# EAGLE design Top (EAGLE 9.6.1)
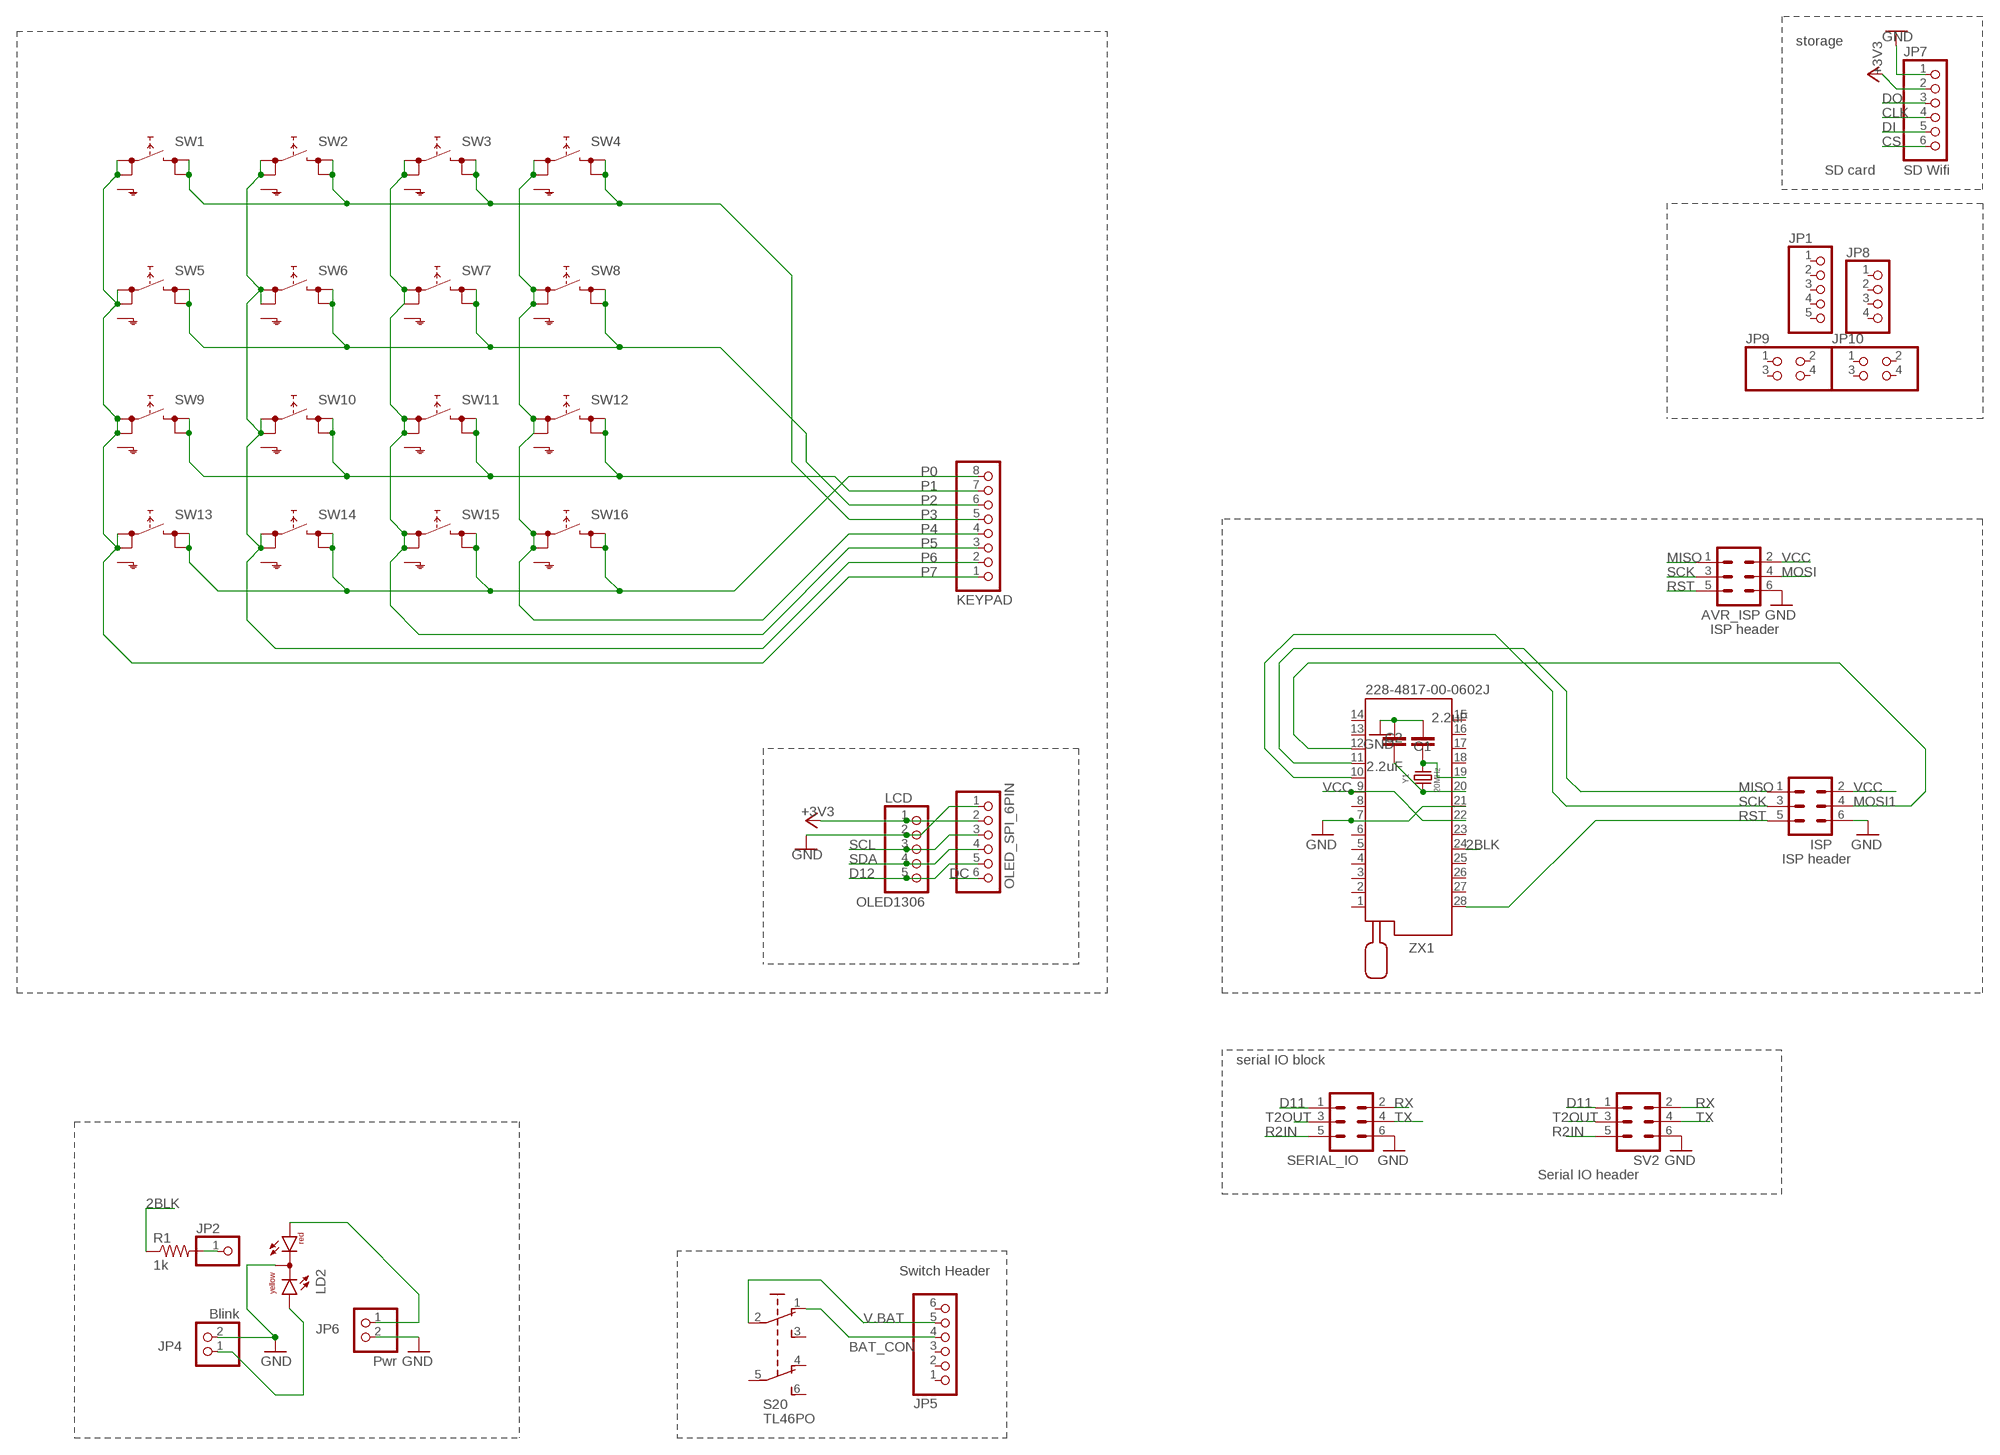
[diagram p0: schematic, sheet 1]

## Parts
AVR_ISP  ML6  [ML6]
C1  2.2uF  2.2UF-1206-50V-10%  [1206]
C2  2.2uF  2.2UF-1206-50V-10%  [1206]
ISP  ML6  [ML6]
JP1  PINHD-1X5  [1X05]
JP2  PINHD-1X1  [1X01]
JP4  Blink  PINHD-1X2  [1X02]
JP5  Switch Header  PINHD-1X6  [1X06]
JP6  Pwr  PINHD-1X2  [1X02]
JP7  SD Wifi  PINHD-1X6  [1X06]
JP8  PINHD-1X4  [1X04]
JP9  PINHD-2X2  [2X02]
JP10  PINHD-2X2  [2X02]
KEYPAD  PINHD-1X8  [1X08]
LCD  OLED1306  PINHD-1X5  [1X05]
LD2  DUOLED-RY-C  [DUOLED-C-5MM]
OLED_SPI_6PIN  PINHD-1X6  [1X06]
R1  1k  R-US_M1206  [M1206]
S20  TL46PO  [TL4XPO]
SERIAL_IO  ML6  [ML6]
SV2  ML6  [ML6]
SW1  SKHMPSE010  [SKHMPXE010]
SW2  SKHMPSE010  [SKHMPXE010]
SW3  SKHMPSE010  [SKHMPXE010]
SW4  SKHMPSE010  [SKHMPXE010]
SW5  SKHMPSE010  [SKHMPXE010]
SW6  SKHMPSE010  [SKHMPXE010]
SW7  SKHMPSE010  [SKHMPXE010]
SW8  SKHMPSE010  [SKHMPXE010]
SW9  SKHMPSE010  [SKHMPXE010]
SW10  SKHMPSE010  [SKHMPXE010]
SW11  SKHMPSE010  [SKHMPXE010]
SW12  SKHMPSE010  [SKHMPXE010]
SW13  SKHMPSE010  [SKHMPXE010]
SW14  SKHMPSE010  [SKHMPXE010]
SW15  SKHMPSE010  [SKHMPXE010]
SW16  SKHMPSE010  [SKHMPXE010]
Y1  20MHz  WE-XTAL_HC49/4HSMX_830061856  [WE-XTAL_HC49/4HSMX]
ZX1  228-4817-00-0602J  [228-4817-00-0602J]

## Nets
2BLK: R1.1 ZX1.24
+3V3: JP7.2 LCD.1 OLED_SPI_6PIN.2
BAT_CON: JP5.4 S20.1(O)
CLK: JP7.4
CS: JP7.6
D11: SERIAL_IO.1 SV2.1
D12: LCD.5 OLED_SPI_6PIN.5
DC: OLED_SPI_6PIN.6
DI: JP7.5
DO: JP7.3
GND: AVR_ISP.6 C1.2 C2.1 ISP.6 JP4.2 JP6.2 JP7.1 LCD.2 LD2.C OLED_SPI_6PIN.1 SERIAL_IO.6 SV2.6 ZX1.7 ZX1.21
MISO: AVR_ISP.1 ISP.1 ZX1.11
MOSI: AVR_ISP.4
MOSI1: ISP.4 ZX1.12
N$1: C1.1 Y1.2 ZX1.19
N$2: C2.2 Y1.1 ZX1.20
N$3: JP6.1 LD2.AR
N$4: JP2.1 R1.2
N$14: JP4.1 LD2.AX(AY)
P0: KEYPAD.8 SW13.3(2.1) SW13.4(2.2) SW14.3(2.1) SW14.4(2.2) SW15.3(2.1) SW15.4(2.2) SW16.3(2.1) SW16.4(2.2)
P1: KEYPAD.7 SW9.3(2.1) SW9.4(2.2) SW10.3(2.1) SW10.4(2.2) SW11.3(2.1) SW11.4(2.2) SW12.3(2.1) SW12.4(2.2)
P2: KEYPAD.6 SW5.3(2.1) SW5.4(2.2) SW6.3(2.1) SW6.4(2.2) SW7.3(2.1) SW7.4(2.2) SW8.3(2.1) SW8.4(2.2)
P3 [POWER]: KEYPAD.5 SW1.3(2.1) SW1.4(2.2) SW2.3(2.1) SW2.4(2.2) SW3.3(2.1) SW3.4(2.2) SW4.3(2.1) SW4.4(2.2)
P4: KEYPAD.4 SW4.1(1.1) SW4.2(1.2) SW8.1(1.1) SW8.2(1.2) SW12.1(1.1) SW12.2(1.2) SW16.1(1.1) SW16.2(1.2)
P5: KEYPAD.3 SW3.1(1.1) SW3.2(1.2) SW7.1(1.1) SW7.2(1.2) SW11.1(1.1) SW11.2(1.2) SW15.1(1.1) SW15.2(1.2)
P6: KEYPAD.2 SW2.1(1.1) SW2.2(1.2) SW6.1(1.1) SW6.2(1.2) SW10.1(1.1) SW10.2(1.2) SW14.1(1.1) SW14.2(1.2)
P7: KEYPAD.1 SW1.1(1.1) SW1.2(1.2) SW5.1(1.1) SW5.2(1.2) SW9.1(1.1) SW9.2(1.2) SW13.1(1.1) SW13.2(1.2)
R2IN: SERIAL_IO.5 SV2.5
RST: AVR_ISP.5 ISP.5 ZX1.28
RX: SERIAL_IO.2 SV2.2
SCK: AVR_ISP.3 ISP.3 ZX1.10
SCL: LCD.3 OLED_SPI_6PIN.3
SDA: LCD.4 OLED_SPI_6PIN.4
T2OUT: SERIAL_IO.3 SV2.3
TX: SERIAL_IO.4 SV2.4
V.BAT: JP5.5 S20.2(P)
VCC: AVR_ISP.2 ISP.2 ZX1.9 ZX1.22
Unconnected: JP1.1 JP1.2 JP1.3 JP1.4 JP1.5 JP5.1 JP5.2 JP5.3 JP5.6 JP8.1 JP8.2 JP8.3 JP8.4 JP9.1 JP9.2 JP9.3 JP9.4 JP10.1 JP10.2 JP10.3 JP10.4 S20.3(S) S20.4(O1) S20.5(P1) S20.6(S1) SW1.5(SH) SW2.5(SH) SW3.5(SH) SW4.5(SH) SW5.5(SH) SW6.5(SH) SW7.5(SH) SW8.5(SH) SW9.5(SH) SW10.5(SH) SW11.5(SH) SW12.5(SH) SW13.5(SH) SW14.5(SH) SW15.5(SH) SW16.5(SH) ZX1.1 ZX1.2 ZX1.3 ZX1.4 ZX1.5 ZX1.6 ZX1.8 ZX1.13 ZX1.14 ZX1.15 ZX1.16 ZX1.17 ZX1.18 ZX1.23 ZX1.25 ZX1.26 ZX1.27

## Notes on the sheet
- storage
- SD card
- ISP header
- ISP header
- serial IO block
- Serial IO header

## Library data of the parts
AVR_ISP ISP SERIAL_IO SV2 = con-harting-ml:ML6: HARTING
C1 C2 = SparkFun-Capacitors:2.2UF: 2.2µF ceramic capacitors A capacitor is a passive two-terminal electrical component used to store electrical energy temporarily in an electric field.; PROD_ID: CAP-10009
JP1 LCD = pinhead:PINHD-1X5: PIN HEADER
JP2 = pinhead:PINHD-1X1: PIN HEADER
JP4 JP6 = pinhead:PINHD-1X2: PIN HEADER
JP5 JP7 OLED_SPI_6PIN = pinhead:PINHD-1X6: PIN HEADER
JP8 = pinhead:PINHD-1X4: PIN HEADER
JP9 JP10 = pinhead:PINHD-2X2: PIN HEADER
KEYPAD = pinhead:PINHD-1X8: PIN HEADER
LD2 = led:DUOLED-RY-C: DUO LED 2 colors (red/yellow), 5 mm, round, common Cathode www.ligitek.com or other producers.
R1 = rcl:R-US_: RESISTOR, American symbol; SPICEPREFIX: R
S20 = switch:TL46PO: TINY SWITCH ON - ON Source: http://www2.produktinfo.conrad.com/datenblaetter/700000-724999/705152-da-01-de-Subminiaturschalter_TL_36YO.pdf
SW1-SW16 = switch:SKHMP*E010: 6.2 X 6.5mm TACT Switch (SMD) Source: http://www3.alps.co.jp/WebObjects/catalog.woa/PDF/E/Switch/Tact/SKHM/SKHM.PDF
Y1 = Wurth_Quartz Crystals & Oscillators_WE-XTAL:WE-XTAL_HC49/4HSMX: WE-XTAL Quartz Crystal Characteristics SMT and THT models Hermetically sealed Frequencies between 1.8432 MHz and 50 MHz Tolerances down to ±10 ppm available Maximum operating temperatures range: -40 °C to 85 °C Stabilities down to ±10 ppm available Applications Microprocessor Wireless Communication Devices Industrial Devices Wired Communication (e.g. Ethernet and USB) IoT Optical Network Audio and Multimedia Devices Test and Measurement Equipment Navigation and Locators Wearables <https://www.we-online.com/catalog/media/o135919v209%20Family_WE-XTAL_IQXC-42.jpg> Details see: https://www.we-online.com/catalog/en/WE-XTAL Updated by Ella Wu , 2019-09-03 2019 (C) Wurth Elektronik; C-LOAD: 18pF; DATASHEET-URL: https://www.we-online.com/catalog/datasheet/830061856.pdf; MOUNT: SMT; PART-NUMBER: 830061856; STABILITY: 10ppm; TOLERANCE: ±10ppm
ZX1 = con-3m:228-?00-0602J: Zero Insertion Force Socked Source: http://www.3M.com/ehpd; MF: 3M; MPN: 228-4817-00-0602J; OC_FARNELL: 1252775; OC_NEWARK: 85K7834

## Net classes
0 default: width 0.254 mm, clearance 0.254 mm
1 POWER: width 0.254 mm, clearance 0.254 mm

## Board
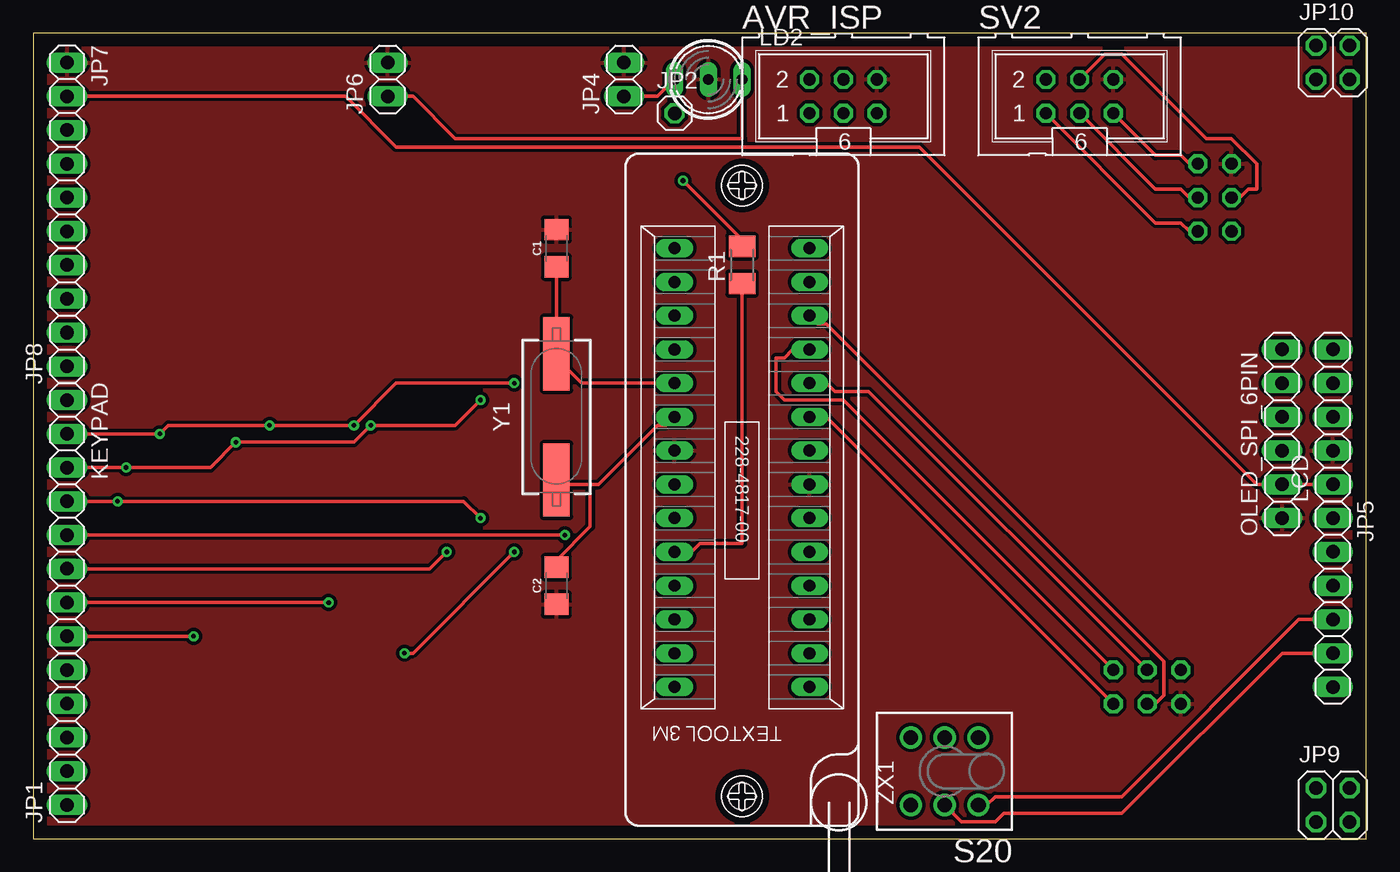
[diagram p1: board, top side]
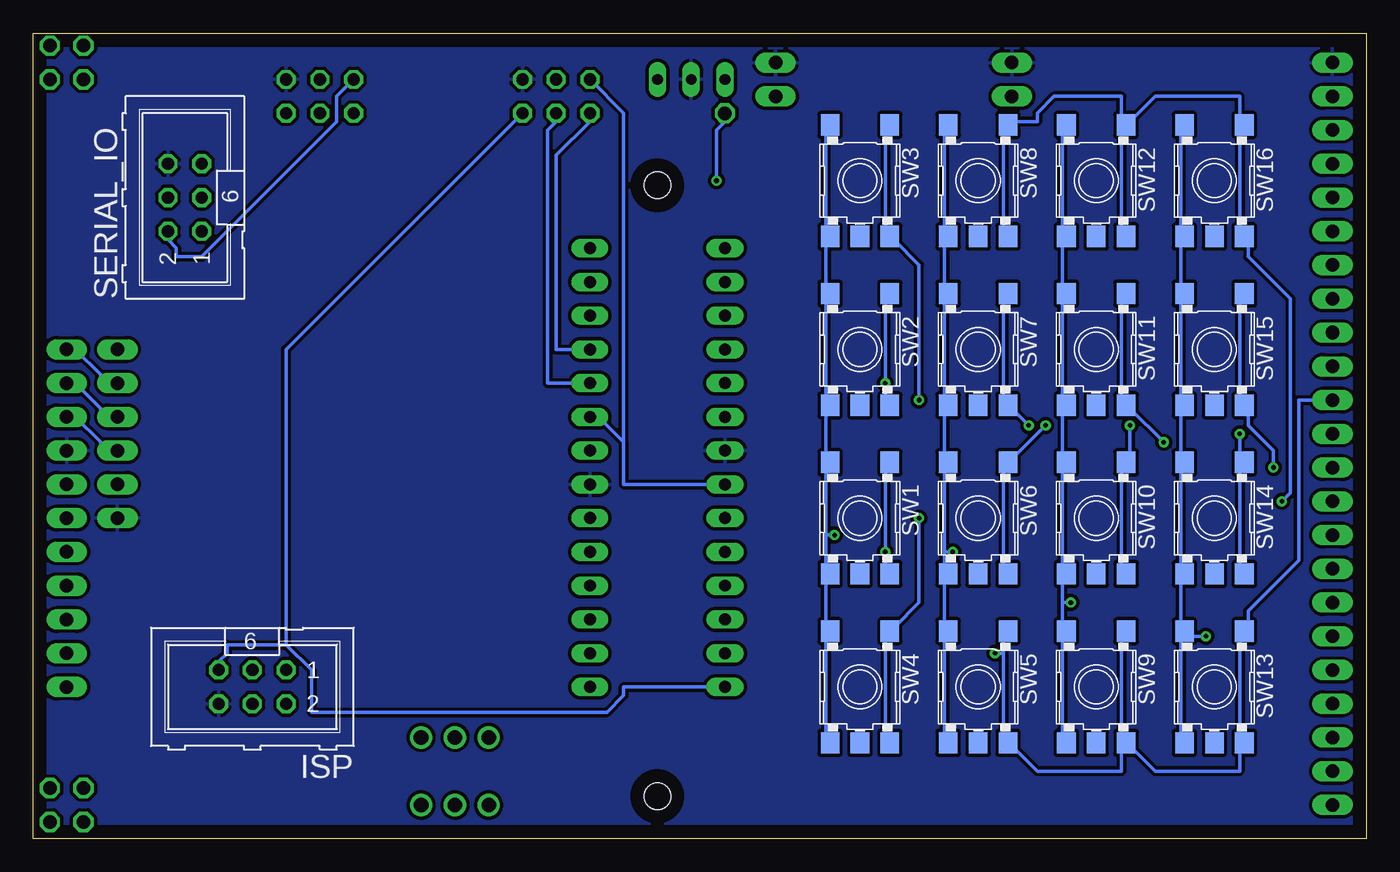
[diagram p2: board, bottom side, seen from below]

Size 100.31 x 60.63 mm. Coordinates in mm from the lower left corner, seen from the top.
Outline: 0,0 100.31,0 100.31,60.63 0,60.63 0,0
Copper layers (1*16): Top 0.035mm / dielectric 1.5mm / Bottom 0.035mm
Design rules "default": minimum track width 6mil, minimum drill 0.35mm, track to track 6mil, track to pad 6mil, pad to pad 6mil, via to via 6mil, smd to smd 6mil, copper to edge 40mil, drill to drill 6mil, minimum pad ring 10mil, minimum via ring 8mil, stop-mask expansion 4mil, vias tented up to drill 0mil, thermal gap 10mil

### Footprints (pad centres in the part's own frame; a part is rotated, then mirrored left to right if it is on the bottom)
ML6 = drill 0.914 octagon: 1 -2.54,-1.27; 2 -2.54,1.27; 3 0,-1.27; 4 0,1.27; 5 2.54,-1.27; 6 2.54,1.27
1206 = smd 1.6 x 1.8: 1 -1.4,0; 2 1.4,0
1X05 = drill 1.016 long: 1 -5.08,0; 2 -2.54,0; 3 0,0; 4 2.54,0; 5 5.08,0
1X01 = drill 1.016 octagon: 1 0,0
1X02 = drill 1.016 long: 1 -1.27,0; 2 1.27,0
1X06 = drill 1.016 long: 1 -6.35,0; 2 -3.81,0; 3 -1.27,0; 4 1.27,0; 5 3.81,0; 6 6.35,0
1X04 = drill 1.016 long: 1 -3.81,0; 2 -1.27,0; 3 1.27,0; 4 3.81,0
2X02 = drill 1.016 octagon: 1 -1.27,-1.27; 2 -1.27,1.27; 3 1.27,-1.27; 4 1.27,1.27
1X08 = drill 1.016 long: 1 -8.89,0; 2 -6.35,0; 3 -3.81,0; 4 -1.27,0; 5 1.27,0; 6 3.81,0; 7 6.35,0; 8 8.89,0
DUOLED-C-5MM = drill 0.813 long: AR 2.54,0; AX -2.54,0; C 0,0
M1206 = smd 1.6 x 2: 1 -1.4,0; 2 1.4,0
TL4XPO = drill 1.1 pad 1.676: 1 -2.54,2.54; 2 0,2.54; 3 2.54,2.54; 4 -2.54,-2.54; 5 0,-2.54; 6 2.54,-2.54
SKHMPXE010 = smd 1.6 x 1.4: 1 -4.2,2.25; 2 4.2,2.25; 3 -4.2,-2.25; 4 4.2,-2.25; 5 4.2,0
WE-XTAL_HC49/4HSMX = smd 5.5 x 2: 1 -4.75,0; 2 4.75,0
228-4817-00-0602J = drill 0.9 long: 1 -16.51,-5.08; 2 -13.97,-5.08; 3 -11.43,-5.08; 4 -8.89,-5.08; 5 -6.35,-5.08; 6 -3.81,-5.08; 7 -1.27,-5.08; 8 1.27,-5.08; 9 3.81,-5.08; 10 6.35,-5.08; 11 8.89,-5.08; 12 11.43,-5.08; 13 13.97,-5.08; 14 16.51,-5.08; 15 16.51,5.08; 16 13.97,5.08; 17 11.43,5.08; 18 8.89,5.08; 19 6.35,5.08; 20 3.81,5.08; 21 1.27,5.08; 22 -1.27,5.08; 23 -3.81,5.08; 24 -6.35,5.08; 25 -8.89,5.08; 26 -11.43,5.08; 27 -13.97,5.08; 28 -16.51,5.08 | hole 2: 21.24,0; -24.74,0

### Placement (x,y rotation side)
AVR_ISP  60.96,55.88 0 top
C1  39.37,44.45 90 top
C2  39.37,19.05 90 top
ISP  83.82,11.43 180 bottom
JP1  2.54,7.62 90 top
JP2  48.26,54.61 0 top
JP4  44.45,57.15 90 top
JP5  97.79,17.78 270 top
JP6  26.67,57.15 90 top
JP7  2.54,52.07 270 top
JP8  2.54,39.37 90 top
JP9  97.79,2.54 0 top
JP10  97.79,58.42 0 top
KEYPAD  2.54,24.13 270 top
LCD  97.79,31.75 90 top
LD2  50.8,57.15 0 top
OLED_SPI_6PIN  93.98,30.48 90 top
R1  53.34,43.18 90 top
S20  68.58,5.08 180 top
SERIAL_IO  88.9,48.26 90 bottom
SV2  78.74,55.88 0 top
SW1  38.1,24.13 270 bottom
SW2  38.1,36.83 270 bottom
SW3  38.1,49.53 270 bottom
SW4  38.1,11.43 270 bottom
SW5  29.21,11.43 270 bottom
SW6  29.21,24.13 270 bottom
SW7  29.21,36.83 270 bottom
SW8  29.21,49.53 270 bottom
SW9  20.32,11.43 270 bottom
SW10  20.32,24.13 270 bottom
SW11  20.32,36.83 270 bottom
SW12  20.32,49.53 270 bottom
SW13  11.43,11.43 270 bottom
SW14  11.43,24.13 270 bottom
SW15  11.43,36.83 270 bottom
SW16  11.43,49.53 270 bottom
Y1  39.37,31.75 90 top
ZX1  53.34,27.94 90 top

### Tracks (layer width: path | path; a pad name or v marks a point on that pad's centre or on a via)
2BLK
  Top 0.254: R1.1 53.34,22.23 50.16,22.23 49.53,21.59 ZX1.24
+3V3
  Top 0.254: LCD.1 OLED_SPI_6PIN.2 92.08,26.67 66.67,52.07 27.3,52.07 23.5,55.88 JP7.2
BAT_CON
  Top 0.254: JP5.4 95.25,16.51 81.92,3.17 72.39,3.17 71.75,2.54 S20.1
D11
  Top 0.254: SV2.1 84.45,46.35 86.36,46.35 87,45.72 SERIAL_IO.1
D12
  Bottom 0.254: OLED_SPI_6PIN.5 95.25,34.29 95.25,34.92 97.16,36.83 LCD.5
GND
  pour Top: 0,0 100.33,0 100.33,60.96 0,60.96
  pour Bottom: 0,60.96 0,0 100.33,0 100.33,60.96
MISO
  Top 0.254: ISP.1 60.96,33.02 56.52,33.02 55.88,33.66 55.88,36.2 56.52,36.2 57.15,36.83 ZX1.11
  Bottom 0.254: ZX1.11 60.96,36.83 60.96,51.44 58.42,53.98 AVR_ISP.1
MOSI1
  Top 0.254: ZX1.12 59.05,38.73 59.69,38.73 85.09,13.34 85.09,10.79 84.45,10.16 ISP.4
N$1
  Top 0.254: C1.1 Y1.2 39.37,36.2 41.27,34.29 ZX1.19
N$2
  Top 0.254: 41.91,26.67 41.91,23.5 39.37,20.95 C2.2 | 41.91,26.67 39.37,26.67 Y1.1 | ZX1.20 47.62,31.11 46.99,31.11 42.55,26.67 41.91,26.67
N$3
  Top 0.254: LD2.AR 53.34,52.7 31.75,52.7 28.57,55.88 JP6.1
N$4  (via drill 0.35)
  Top 0.254: v48.9,49.53 53.34,45.09 R1.2
  Bottom 0.254: v48.9,49.53 48.9,53.34 48.26,53.98 JP2.1
N$14
  Top 0.254: LD2.AX 46.99,55.88 JP4.1
P0  (via drill 0.35)
  Top 0.254: v12.06,15.24 KEYPAD.8
  Bottom 0.254: SW16.3 13.97,53.34 13.97,45.72 SW16.4 13.97,45.09 13.97,41.27 SW15.3 13.97,40.64 13.97,33.02 SW15.4 13.97,32.38 13.97,28.57 SW14.3 13.97,27.94 13.97,20.32 SW14.4 13.97,19.68 13.97,15.88 SW13.3 | SW13.4 13.97,7.62 13.97,15.24 SW13.3 | v12.06,15.24 13.34,15.24 SW13.3
P1  (via drill 0.35)
  Top 0.254: v22.23,17.78 KEYPAD.7
  Bottom 0.254: SW12.3 22.86,53.34 22.86,45.72 SW12.4 22.86,45.09 22.86,41.27 SW11.3 22.86,40.64 22.86,33.02 SW11.4 22.86,32.38 22.86,28.57 SW10.3 22.86,27.94 22.86,20.32 SW10.4 22.86,19.68 22.86,17.78 | SW9.4 22.86,7.62 22.86,15.24 SW9.3 22.86,15.88 22.86,17.78 | 22.86,17.78 v22.23,17.78
P2  (via drill 0.35)
  Top 0.254: KEYPAD.6 29.84,20.32 v31.11,21.59
  Bottom 0.254: SW8.3 31.75,53.34 31.75,45.72 SW8.4 31.75,45.09 31.75,41.27 SW7.3 31.75,40.64 31.75,33.02 SW7.4 31.75,32.38 31.75,28.57 SW6.3 31.75,27.94 31.75,21.59 | SW5.4 31.75,7.62 31.75,15.24 SW5.3 31.75,15.88 31.75,19.68 SW6.4 31.75,20.32 31.75,21.59 | 31.75,21.59 v31.11,21.59
P3  (via drill 0.35)
  Top 0.254: v40.01,22.86 KEYPAD.5
  Bottom 0.254: SW3.3 40.64,53.34 40.64,45.72 SW3.4 40.64,45.09 40.64,41.27 SW2.3 40.64,40.64 40.64,33.02 SW2.4 40.64,32.38 40.64,28.57 SW1.3 40.64,27.94 40.64,22.86 | SW4.4 40.64,7.62 40.64,15.24 SW4.3 40.64,15.88 40.64,19.68 SW1.4 40.64,20.32 40.64,22.86 | 40.64,22.86 v40.01,22.86
P4  (via drill 0.35)
  Top 0.254: KEYPAD.4 v6.35,25.4 32.38,25.4 v33.66,24.13
  Bottom 0.254: SW4.2 36.2,7.62 36.2,15.24 SW4.1 35.56,15.88 33.66,17.78 v33.66,24.13 | SW8.2 27.3,45.72 27.3,53.34 SW8.1 26.67,53.98 24.77,53.98 24.77,54.61 23.5,55.88 18.41,55.88 18.41,53.98 SW12.1 | SW12.2 18.41,45.72 18.41,53.34 SW12.1 | v6.35,25.4 5.71,26.04 5.71,40.64 8.89,43.81 8.89,45.09 SW16.2 9.53,45.72 9.53,53.34 SW16.1 9.53,53.98 9.53,55.88 15.88,55.88 17.78,53.98 SW12.1
P5  (via drill 0.35)
  Top 0.254: KEYPAD.3 v6.99,27.94 13.34,27.94 v15.24,29.84 24.13,29.84 v25.4,31.11 31.75,31.11 v33.66,33.02
  Bottom 0.254: SW3.1 36.2,53.34 36.2,45.72 SW3.2 35.56,45.09 33.66,43.18 v33.66,33.02 | SW7.1 27.3,40.64 27.3,33.02 SW7.2 26.67,32.38 v25.4,31.11 | SW11.1 18.41,40.64 18.41,33.02 SW11.2 17.78,32.38 v15.24,29.84 | SW15.1 9.53,40.64 9.53,33.02 SW15.2 8.89,32.38 8.89,31.11 6.99,29.21 v6.99,27.94
P6  (via drill 0.35)
  Top 0.254: KEYPAD.2 v9.53,30.48 10.16,31.11 v17.78,31.11 v24.13,31.11 27.3,34.29 v36.2,34.29
  Bottom 0.254: SW2.2 36.2,33.02 v36.2,34.29 36.2,40.64 SW2.1 | SW6.2 27.3,20.32 27.3,27.94 SW6.1 26.67,28.57 v24.13,31.11 | SW10.2 18.41,20.32 18.41,27.94 SW10.1 17.78,28.57 v17.78,31.11 | SW14.2 9.53,20.32 9.53,27.94 SW14.1 9.53,28.57 v9.53,30.48
P7  (via drill 0.35)
  Top 0.254: v36.2,21.59 28.57,13.97 v27.94,13.97
  Bottom 0.254: SW1.2 36.2,20.32 v36.2,21.59 36.2,27.94 SW1.1 | 27.3,13.97 27.3,15.24 SW5.1 | 27.3,13.97 27.3,7.62 SW5.2 26.67,6.99 24.77,5.08 18.41,5.08 18.41,6.99 SW9.2 | SW9.2 18.41,7.62 18.41,15.24 SW9.1 | KEYPAD.1 5.08,33.02 5.08,20.95 8.89,17.14 8.89,15.88 SW13.1 9.53,15.24 9.53,7.62 SW13.2 9.53,6.99 9.53,5.08 15.88,5.08 17.78,6.99 SW9.2 | 27.3,13.97 v27.94,13.97
R2IN
  Top 0.254: SV2.5 84.45,51.44 86.36,51.44 87,50.8 SERIAL_IO.5
RST
  Bottom 0.254: ZX1.28 55.88,11.43 55.88,10.79 57.15,9.53 79.38,9.53 79.38,12.7 81.28,14.61 | 81.28,14.61 85.72,14.61 85.72,13.97 86.36,13.34 ISP.5 | AVR_ISP.5 81.28,36.83 81.28,14.61
RX
  Bottom 0.254: SV2.2 77.47,55.88 77.47,53.98 87.63,43.81 89.53,43.81 89.53,44.45 90.17,45.09 SERIAL_IO.2
SCK
  Top 0.254: ISP.3 62.87,33.66 60.33,33.66 59.69,34.29 ZX1.10
  Bottom 0.254: ZX1.10 61.59,34.29 61.59,53.34 60.96,53.98 AVR_ISP.3
SCL
  Bottom 0.254: OLED_SPI_6PIN.3 95.25,29.21 95.25,29.84 97.16,31.75 LCD.3
SDA
  Bottom 0.254: OLED_SPI_6PIN.4 95.25,31.75 95.25,32.38 97.16,34.29 LCD.4
T2OUT
  Top 0.254: SV2.3 84.45,48.9 86.36,48.9 87,48.26 SERIAL_IO.3
TX
  Top 0.254: SV2.4 80.64,59.05 81.92,59.05 88.27,52.7 90.17,52.7 92.08,50.8 92.08,48.9 91.44,48.9 90.81,48.26 SERIAL_IO.4
V.BAT
  Top 0.254: JP5.5 93.98,13.97 81.92,1.91 73.03,1.91 72.39,1.27 69.85,1.27 69.22,1.91 69.22,2.54 S20.2
VCC
  Top 0.254: ISP.2 59.69,31.75 ZX1.9
  Bottom 0.254: ZX1.22 55.88,26.67 55.88,29.84 | 55.88,29.84 57.78,31.75 ZX1.9 | AVR_ISP.2 55.88,54.61 55.88,29.84